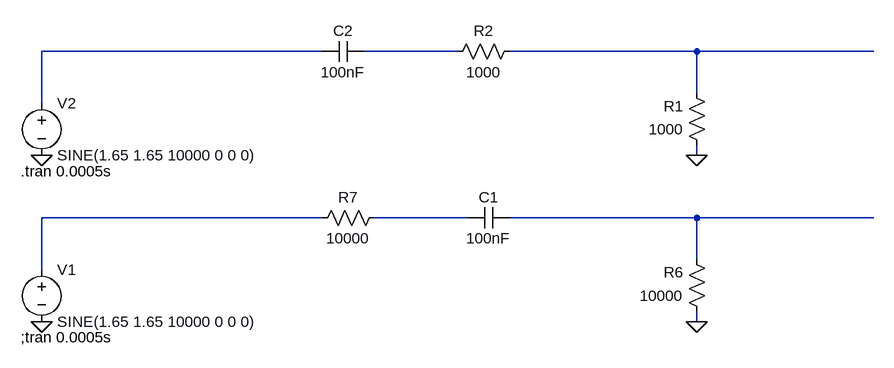
[diagram p0: schematic speaker_volume.asc]
speaker_volume.asc, the LTspice schematic file:
Version 4
SHEET 1 2328 724
WIRE 352 -192 -80 -192
WIRE 560 -192 416 -192
WIRE 928 -192 640 -192
WIRE 1200 -192 928 -192
WIRE 928 -128 928 -192
WIRE -80 -112 -80 -192
WIRE 928 -32 928 -48
WIRE 352 64 -80 64
WIRE 576 64 432 64
WIRE 928 64 640 64
WIRE 1200 64 928 64
WIRE 928 128 928 64
WIRE -80 144 -80 64
WIRE 928 224 928 208
FLAG -80 224 0
FLAG 928 224 0
FLAG -80 -32 0
FLAG 928 -32 0
SYMBOL voltage -80 128 R0
WINDOW 123 0 0 Left 2
WINDOW 39 0 0 Left 2
SYMATTR InstName V1
SYMATTR Value SINE(1.65 1.65 10000 0 0 0)
SYMBOL cap 640 48 R90
WINDOW 0 0 32 VBottom 2
WINDOW 3 32 32 VTop 2
SYMATTR InstName C1
SYMATTR Value 100nF
SYMBOL res 944 224 R180
WINDOW 0 36 76 Left 2
WINDOW 3 36 40 Left 2
SYMATTR InstName R6
SYMATTR Value 10000
SYMBOL res 448 48 R90
WINDOW 0 0 56 VBottom 2
WINDOW 3 32 56 VTop 2
SYMATTR InstName R7
SYMATTR Value 10000
SYMBOL voltage -80 -128 R0
WINDOW 123 0 0 Left 2
WINDOW 39 0 0 Left 2
SYMATTR InstName V2
SYMATTR Value SINE(1.65 1.65 10000 0 0 0)
SYMBOL cap 416 -208 R90
WINDOW 0 0 32 VBottom 2
WINDOW 3 32 32 VTop 2
SYMATTR InstName C2
SYMATTR Value 100nF
SYMBOL res 944 -32 R180
WINDOW 0 36 76 Left 2
WINDOW 3 36 40 Left 2
SYMATTR InstName R1
SYMATTR Value 1000
SYMBOL res 656 -208 R90
WINDOW 0 0 56 VBottom 2
WINDOW 3 32 56 VTop 2
SYMATTR InstName R2
SYMATTR Value 1000
TEXT -112 248 Left 2 !;tran 0.0005s
TEXT -112 -8 Left 2 !.tran 0.0005s

The netlist it stands for:
* speaker_volume.asc
V1 N004 0 SINE(1.65 1.65 10000 0 0 0)
C1 N006 N005 100nF
R6 0 N006 10000
R7 N005 N004 10000
V2 N001 0 SINE(1.65 1.65 10000 0 0 0)
C2 N002 N001 100nF
R1 0 N003 1000
R2 N003 N002 1000
;tran 0.0005s
.tran 0.0005s
.backanno
.end